# Altium schematic sheet HVP_BatteryCharger_v1.0.SchDoc
size A3; Organization: SEW EURODRIVE; Address1: Jose Rubim Rd.; Address2: Santos Dumont Rd.; Address3: 205; Address4: Indaiatuba/SP; Address5: Brazil
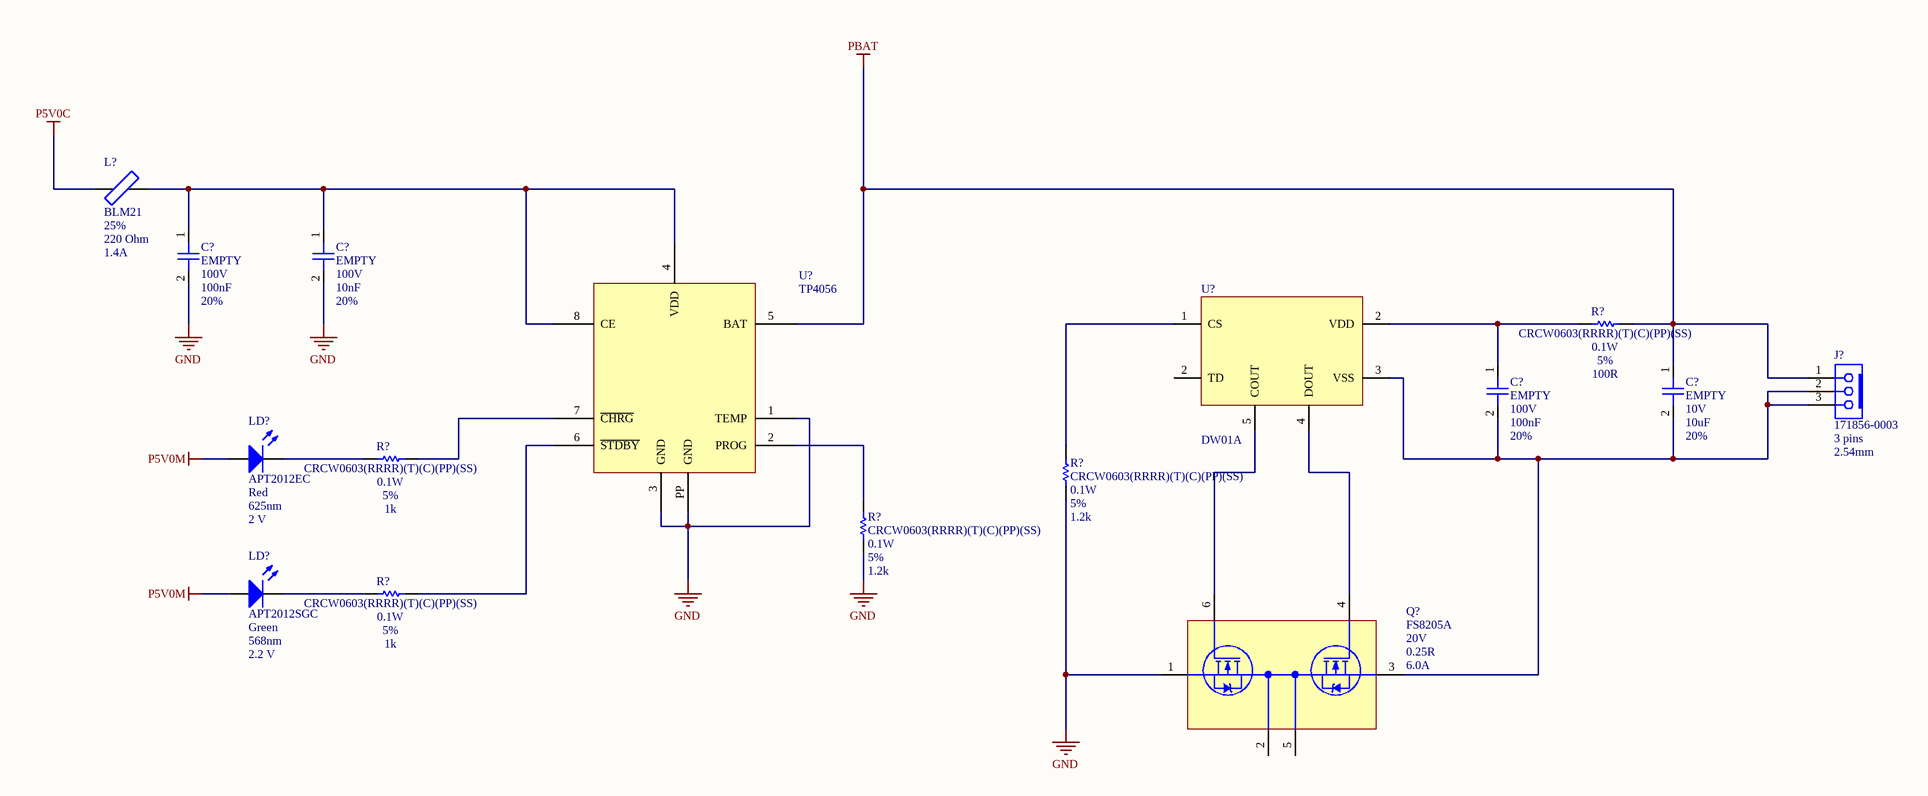
[diagram p0: HVP_BatteryCharger_v1.0.SchDoc]

## Parts
(Parts that share a designator on the sheet are numbered #1, #2 ... from top to bottom, then left to right.)
C?#1  value 100nF  PartNumber1: EMPTY  Voltage: 100V  Tolerance: 20%  [CAP0603]  (hidden comment: CC0603)
C?#2  value 10nF  PartNumber1: EMPTY  Voltage: 100V  Tolerance: 20%  [CAP0603]  (hidden comment: CC0603)
C?#3  value 100nF  PartNumber1: EMPTY  Voltage: 100V  Tolerance: 20%  [CAP0603]  (hidden comment: CC0603)
C?#4  value 10uF  PartNumber1: EMPTY  Voltage: 10V  Tolerance: 20%  [CAP0805]  (hidden comment: CC0805)
J?  Pins: 3 pins  Pitch: 2.54mm  [CONKK03STRMALE_100_100]  (hidden comment: 171856-0003)
L?  value 220 Ohm  Tolerance: 25%  Current: 1.4A  [IND0805]  (hidden comment: BLM21)
LD?#1  Colour: Red  Wavelength: 625nm  Vled: 2 V  [LED0805]  (hidden comment: APT2012EC)
LD?#2  Colour: Green  Wavelength: 568nm  Vled: 2.2 V  [LED0805]  (hidden comment: APT2012SGC)
Q?  Vdds: 20V  Rds(on): 0.25R  Id: 6.0A  [TSOT23-6]  (hidden comment: FS8205A)
R?#1  value 100R  PartNumber1: CRCW0603(RRRR)(T)(C)(PP)(SS)  Power: 0.1W  Tolerance: 5%  [RES0603]  (hidden comment: Chip Resistor)
R?#2  value 1k  PartNumber1: CRCW0603(RRRR)(T)(C)(PP)(SS)  Power: 0.1W  Tolerance: 5%  [RES0603]  (hidden comment: Chip Resistor)
R?#3  value 1.2k  PartNumber1: CRCW0603(RRRR)(T)(C)(PP)(SS)  Power: 0.1W  Tolerance: 5%  [RES0603]  (hidden comment: Chip Resistor)
R?#4  value 1.2k  PartNumber1: CRCW0603(RRRR)(T)(C)(PP)(SS)  Power: 0.1W  Tolerance: 5%  [RES0603]  (hidden comment: Chip Resistor)
R?#5  value 1k  PartNumber1: CRCW0603(RRRR)(T)(C)(PP)(SS)  Power: 0.1W  Tolerance: 5%  [RES0603]  (hidden comment: Chip Resistor)
U?#1  DW01A  [SOT23-6]
U?#2  TP4056  [SOIC-8P-3.9mm]

## Nets
GND: C?#1.2 C?#2.2 Q?.1(S1) R?#3.1 R?#4.1 U?#2.1(TEMP) U?#2.3(GND) U?#2.PP(GND)
P5V0C: L?.1
P5V0M: LD?#1.A LD?#2.A
PBAT: C?#4.1 J?.1 R?#1.1 U?#2.5(BAT)
NetC?#1_1: C?#1.1 C?#2.1 L?.2 U?#2.4(VDD) U?#2.8(CE)
NetC?#3_1: C?#3.1 R?#1.2 U?#1.2(VDD)
NetC?#3_2: C?#3.2 C?#4.2 J?.2 J?.3 Q?.3(S2) U?#1.3(VSS)
NetLD?#1_K: LD?#1.K R?#2.1
NetLD?#2_K: LD?#2.K R?#5.1
NetQ?_4: Q?.4(G2) U?#1.4(DOUT)
NetQ?_6: Q?.6(G1) U?#1.5(COUT)
NetR?#2_2: R?#2.2 U?#2.7(~{CHRG})
NetR?#3_2: R?#3.2 U?#1.1(CS)
NetR?#4_2: R?#4.2 U?#2.2(PROG)
NetR?#5_2: R?#5.2 U?#2.6(~{STDBY})

Not connected (* = marked no-connect by the designer): Q? 2(D1/D2) 5(D1/D2)

## Notes on the sheet
- Title
- Author
- Checked By
- Size:
- Revision:
- A3
- Date:
- Project
- Time:
- Sheet
- of
- File:

## Library data of the parts
C?#1-C?#3 = CC0603: Surface Mount Multilayer Ceramic Chip Capacitors  for Commercial Applications; Manufacter1: Yageo; Published: 19-Jun-2016; LatestRevisionDate: 19-Jun-2016; Publisher: Lucas Moraes; PackageReference: CAP0603; PackageDescription: CAP0603;2 Leads
C?#4 = CC0805: Surface Mount Multilayer Ceramic Chip Capacitors  for Commercial Applications; Manufacter1: Yageo; Published: 19-Jun-2016; LatestRevisionDate: 19-Jun-2016; Publisher: Lucas Moraes; PackageReference: CAP0805; PackageDescription: CAP0805;2 Leads
J? = 171856-0003: Headers & Wire Housings KK RPC 100 Hdr FrLk Vert 03; Manufacter1: Molex; LastRevisionNote: Created; Gender: Male; Direction: 180; Published: 20-Dec-2022; LatestRevisionDate: 20-Dec-2022; PackageReference: CONKK03STRMALE_100_100; Publisher: Lucas Moraes; PackageDescription: CONKK03STRMALE_100_100; 3 Leads; Type: Pin; Datasheet: https://www.molex.com/pdm_docs/sd/1718563003_sd.pdf; PartNumber1: 171856-0003
L? = BLM21: Ferrite Beads 0805; Manufacter1: Murata Electronics; LatestRevisionDate: 05-Apr-2023; PackageReference: IND0805; Publisher: Lucas Moraes; PackageDescription: IND0805; 2 Leads; Published: 05-Apr-2023; Datasheet: https://br.mouser.com/datasheet/2/281/ENFA0005-1915781.pdf; Code: *; PartNumber1: BLM21
LD?#1 = APT2012EC: Standard LEDs - SMD 0805 Red; Manufacter1: Kingbright; LastRevisionNote: Created; Published: 29-Dec-2016; PackageReference: LED0805; Publisher: Lucas Moraes; PackageDescription: LED0805; 2 leads; LastRevision: 29-Dec-2016; Datasheet: http://www.us.kingbright.com/images/catalog/SPEC/APT2012EC.pdf; PartNumber1: APT2012EC
LD?#2 = APT2012SGC: Standard LEDs - SMD 0805 Green; Manufacter1: Kingbright; LastRevisionNote: Created; Published: 29-Dec-2016; PackageReference: LED0805; Publisher: Lucas Moraes; PackageDescription: LED0805; 2 leads; LastRevision: 29-Dec-2016; Datasheet: http://www.us.kingbright.com/images/catalog/SPEC/APT2012SGC.pdf; PartNumber1: APT2012SGC
Q? = FS8205A: MOSFET DUAL N-CHANNEL; Manufacter1: Diodes Incorporated; Published: 21-Mar-2023; LatestRevisionDate: 21-Mar-2023; LatestRevisionNote: Created; Publisher: Lucas Moraes; PackageDescription: TSOT23-6; 6 Leads; PackageReference: TSOT23-6; PartNumber1: FS8205A
R?#1-R?#5 = CRCW0603: Thick Film Chip Resistors with CECC Approval,  available with Established Reliability; Manufacter1: Vishay; LatestRevisionDate: 06-May-2016; PackageReference: 0603; Publisher: Lucas Moraes; PackageDescription: SMD 0603; 2 Leads; Published: 06-May-2016
U?#1 = DW01A: Battery Protection IC SOT-23-6; Manufacter1: H&M semi; Published: 20-Jul-2022; LatestRevisionDate: 20-Jul-2022; LatestRevisionNote: Created; PackageReference: SOT-26; Publisher: Lucas Moraes; PackageDescription: SOT-26;6 Leads; Datasheet: https://hmsemi.com/downfile/DW01A.PDF; PartNumber1: DW01A
U?#2 = TP4056: 1A Standalone Linear Li-lon Battery Charger with Thermal Regulation in SOP-8; Manufacter1: NanJing Top Power ASIC Corp; Published: 20-Jul-2022; LatestRevisionDate: 20-Jul-2022; LatestRevisionNote: Created; PackageReference: SOIC-8-3.9mm; Publisher: Lucas Moraes; PackageDescription: SOIC-8-3.9mm;8 Leads; PartNumber1: TP4056